# EAGLE design ServoToolv04 (EAGLE 8.3.0)
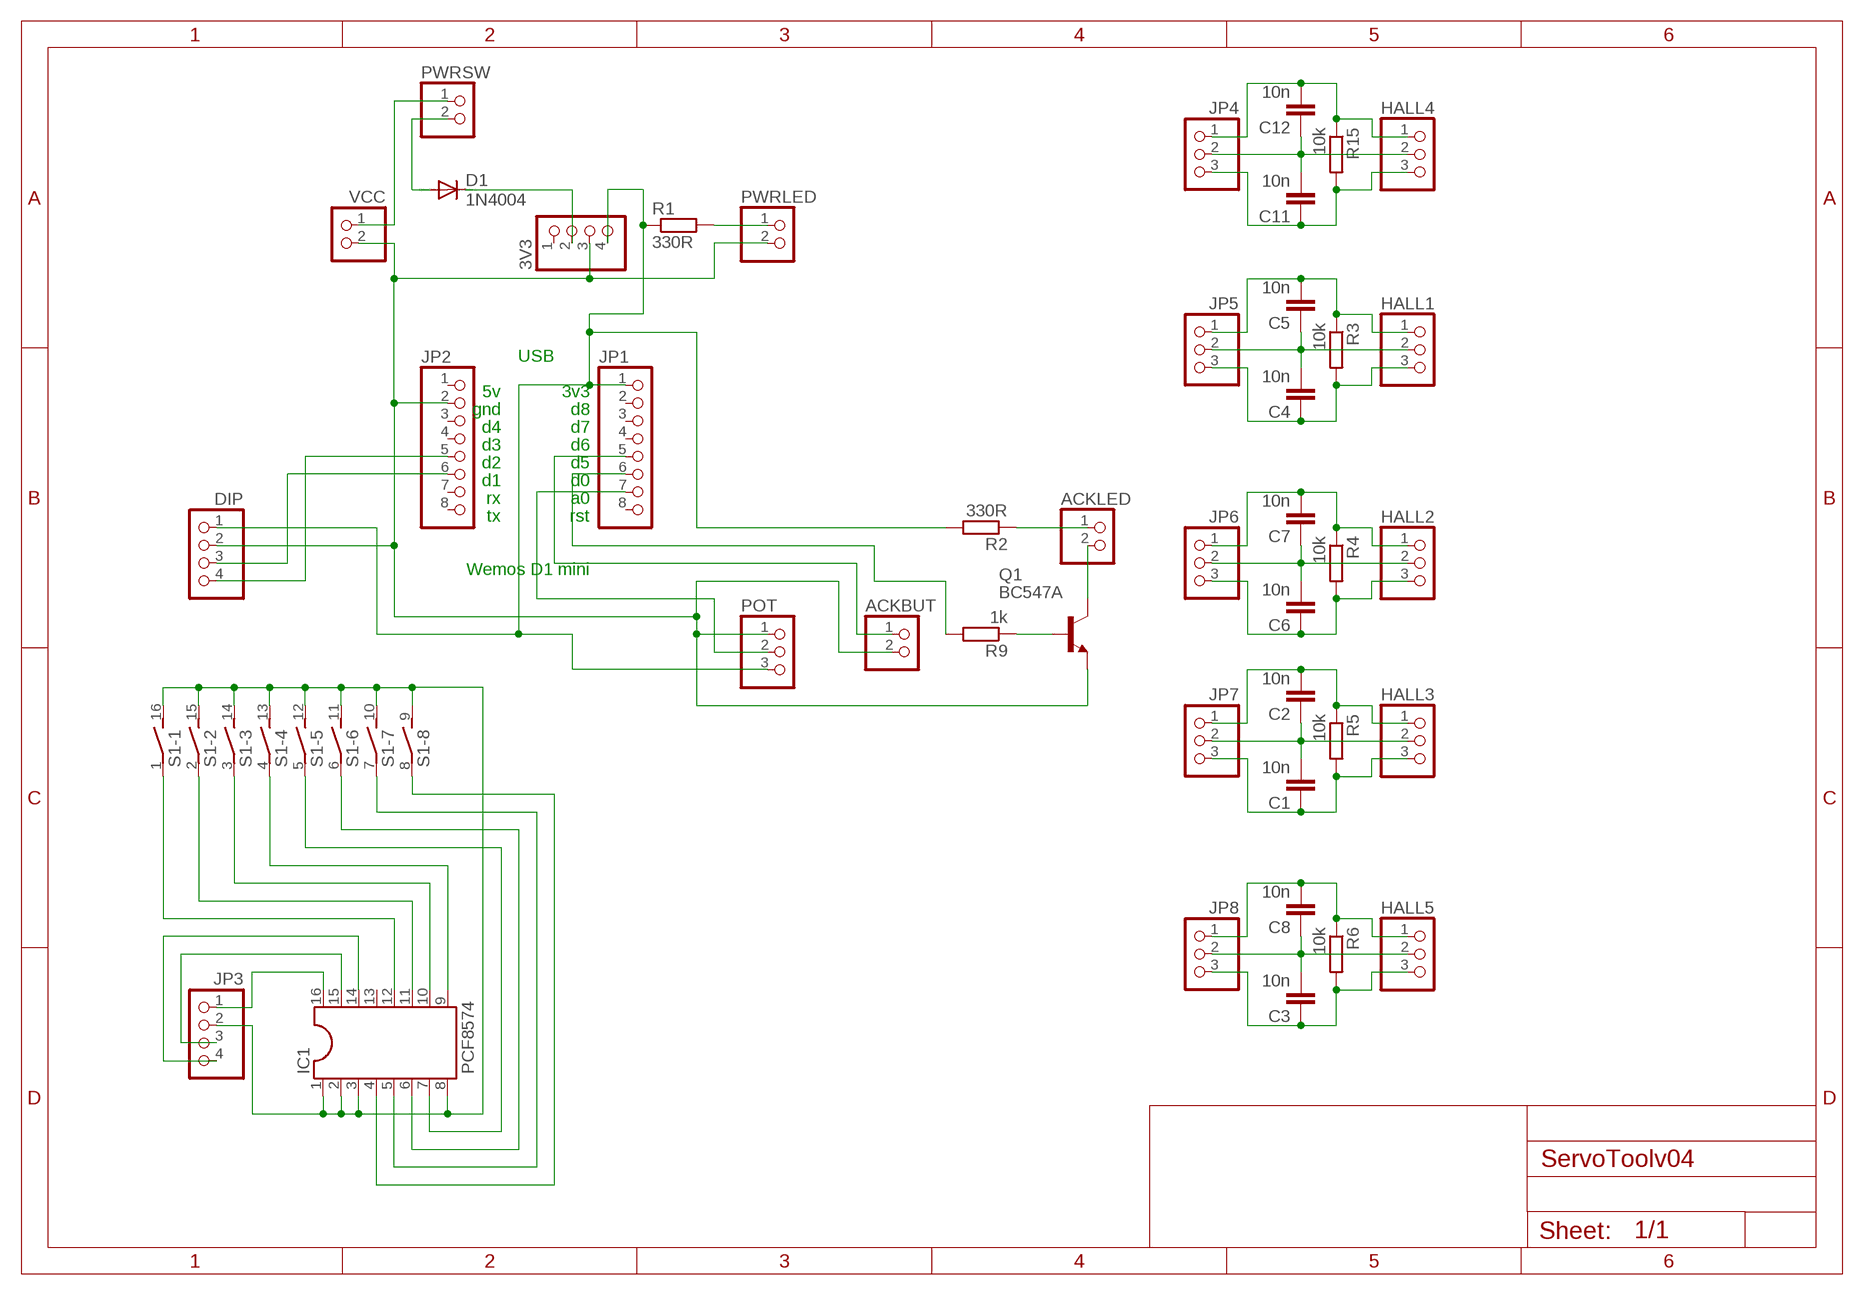
[diagram p0: schematic, sheet 1]

## Parts
3V3  PINHD-1X4  [1X04]
ACKBUT  PINHD-1X2/90  [1X02/90]
ACKLED  PINHD-1X2/90  [1X02/90]
C1  10n  C-EU050-024X044  [C050-024X044]
C2  10n  C-EU050-024X044  [C050-024X044]
C3  10n  C-EU050-024X044  [C050-024X044]
C4  10n  C-EU050-024X044  [C050-024X044]
C5  10n  C-EU050-024X044  [C050-024X044]
C6  10n  C-EU050-024X044  [C050-024X044]
C7  10n  C-EU050-024X044  [C050-024X044]
C8  10n  C-EU050-024X044  [C050-024X044]
C11  10n  C-EU050-024X044  [C050-024X044]
C12  10n  C-EU050-024X044  [C050-024X044]
D1  1N4004  [DO41-10]
DIP  PINHD-1X4/90  [1X04/90]
HALL1  PINHD-1X3  [1X03]
HALL2  PINHD-1X3  [1X03]
HALL3  PINHD-1X3  [1X03]
HALL4  PINHD-1X3  [1X03]
HALL5  PINHD-1X3  [1X03]
IC1  PCF8574  DIL16  [DIL16]
JP1  PINHD-1X8  [1X08]
JP2  PINHD-1X8  [1X08]
JP3  PINHD-1X4/90  [1X04/90]
JP4  PINHD-1X3  [1X03]
JP5  PINHD-1X3  [1X03]
JP6  PINHD-1X3  [1X03]
JP7  PINHD-1X3  [1X03]
JP8  PINHD-1X3  [1X03]
POT  PINHD-1X3/90  [1X03/90]
PWRLED  PINHD-1X2/90  [1X02/90]
PWRSW  PINHD-1X2/90  [1X02/90]
Q1  BC547A  [TO92]
R1  330R  R-EU_0207/10  [0207/10]
R2  330R  R-EU_0207/10  [0207/10]
R3  10k  R-EU_0309/10  [0309/10]
R4  10k  R-EU_0309/10  [0309/10]
R5  10k  R-EU_0309/10  [0309/10]
R6  10k  R-EU_0309/10  [0309/10]
R9  1k  R-EU_0207/10  [0207/10]
R15  10k  R-EU_0309/10  [0309/10]
S1  DIP08S  [DIP08S]
VCC  PINHD-1X2/90  [1X02/90]

## Nets
N$1 [3.3V]: 3V3.4 DIP.1 JP1.1 POT.3 R1.1 R2.2
N$2: DIP.3 JP2.6
N$3: DIP.4 JP2.5
N$4 [5V]: 3V3.2 D1.C
N$5 [5V]: PWRSW.1 VCC.1
N$6: PWRLED.1 R1.2
N$7: Q1.2(B) R9.1
N$8: ACKLED.1 R2.1
N$9: ACKLED.2 Q1.3(C)
N$10: IC1.12 S1.1
N$11: IC1.11 S1.2
N$12: IC1.10 S1.3
N$13: IC1.16 JP3.1
N$14: ACKBUT.1 JP1.5
N$15: JP1.7 POT.2
N$16: C5.2 HALL1.1 JP5.1 R3.1
N$17: JP1.6 R9.2
N$18 [5V]: D1.A PWRSW.2
N$19 [Gnd]: 3V3.3 ACKBUT.2 DIP.2 JP2.2 POT.1 PWRLED.2 Q1.1(E) VCC.2
N$20: C4.2 C5.1 HALL1.2 JP5.2
N$21 [Gnd]: IC1.1 IC1.2 IC1.3 IC1.8 JP3.2 S1.9 S1.10 S1.11 S1.12 S1.13 S1.14 S1.15 S1.16
N$22: IC1.15 JP3.3
N$23: IC1.14 JP3.4
N$24: IC1.9 S1.4
N$25: IC1.7 S1.5
N$26: IC1.6 S1.6
N$27: C4.1 HALL1.3 JP5.3 R3.2
N$28: C6.2 C7.1 HALL2.2 JP6.2
N$29: IC1.5 S1.7
N$30: C7.2 HALL2.1 JP6.1 R4.1
N$31: C6.1 HALL2.3 JP6.3 R4.2
N$32: C1.2 C2.1 HALL3.2 JP7.2
N$33: C2.2 HALL3.1 JP7.1 R5.1
N$34: C1.1 HALL3.3 JP7.3 R5.2
N$35: IC1.4 S1.8
N$36: C3.2 C8.1 HALL5.2 JP8.2
N$37: C8.2 HALL5.1 JP8.1 R6.1
N$38: C3.1 HALL5.3 JP8.3 R6.2
N$55: C11.2 C12.1 HALL4.2 JP4.2
N$56: C11.1 HALL4.3 JP4.3 R15.2
N$57: C12.2 HALL4.1 JP4.1 R15.1
Unconnected: 3V3.1 IC1.13 JP1.2 JP1.3 JP1.4 JP1.8 JP2.1 JP2.3 JP2.4 JP2.7 JP2.8

## Notes on the sheet
- USB
- 5v | 3v3
- gnd | d8
- d4 | d7
- d3 | d6
- d2 | d5
- d1 | d0
- rx | a0
- tx | rst
- Wemos D1 mini

## Library data of the parts
3V3 DIP JP3 = pinhead:PINHD-1X4: PIN HEADER
ACKBUT ACKLED PWRLED PWRSW VCC = pinhead:PINHD-1X2: PIN HEADER
C1-C8 C11 C12 = resistor:C-EU: CAPACITOR, European symbol
D1 = diode:1N4004: DIODE general purpose rectifier, 1 A
HALL1-HALL5 JP4-JP8 POT = pinhead:PINHD-1X3: PIN HEADER
IC1 = ic-package:DIL16: Dual In Line / Socket
JP1 JP2 = pinhead:PINHD-1X8: PIN HEADER
Q1 = transistor-npn:BC547*: NPN Transistor
R1-R6 R9 R15 = resistor:R-EU_: RESISTOR, European symbol
S1 = switch-dil:DIP08S: DIL/CODE SWITCH; OC_FARNELL: unknown; OC_NEWARK: unknown

## Net classes
0 default: width 0.508 mm, clearance 0.254 mm
1 5V: width 0.508 mm, clearance 0.254 mm
2 Gnd: width 0.508 mm, clearance 0.254 mm
4 3.3V: width 0.508 mm, clearance 0.254 mm

## Board
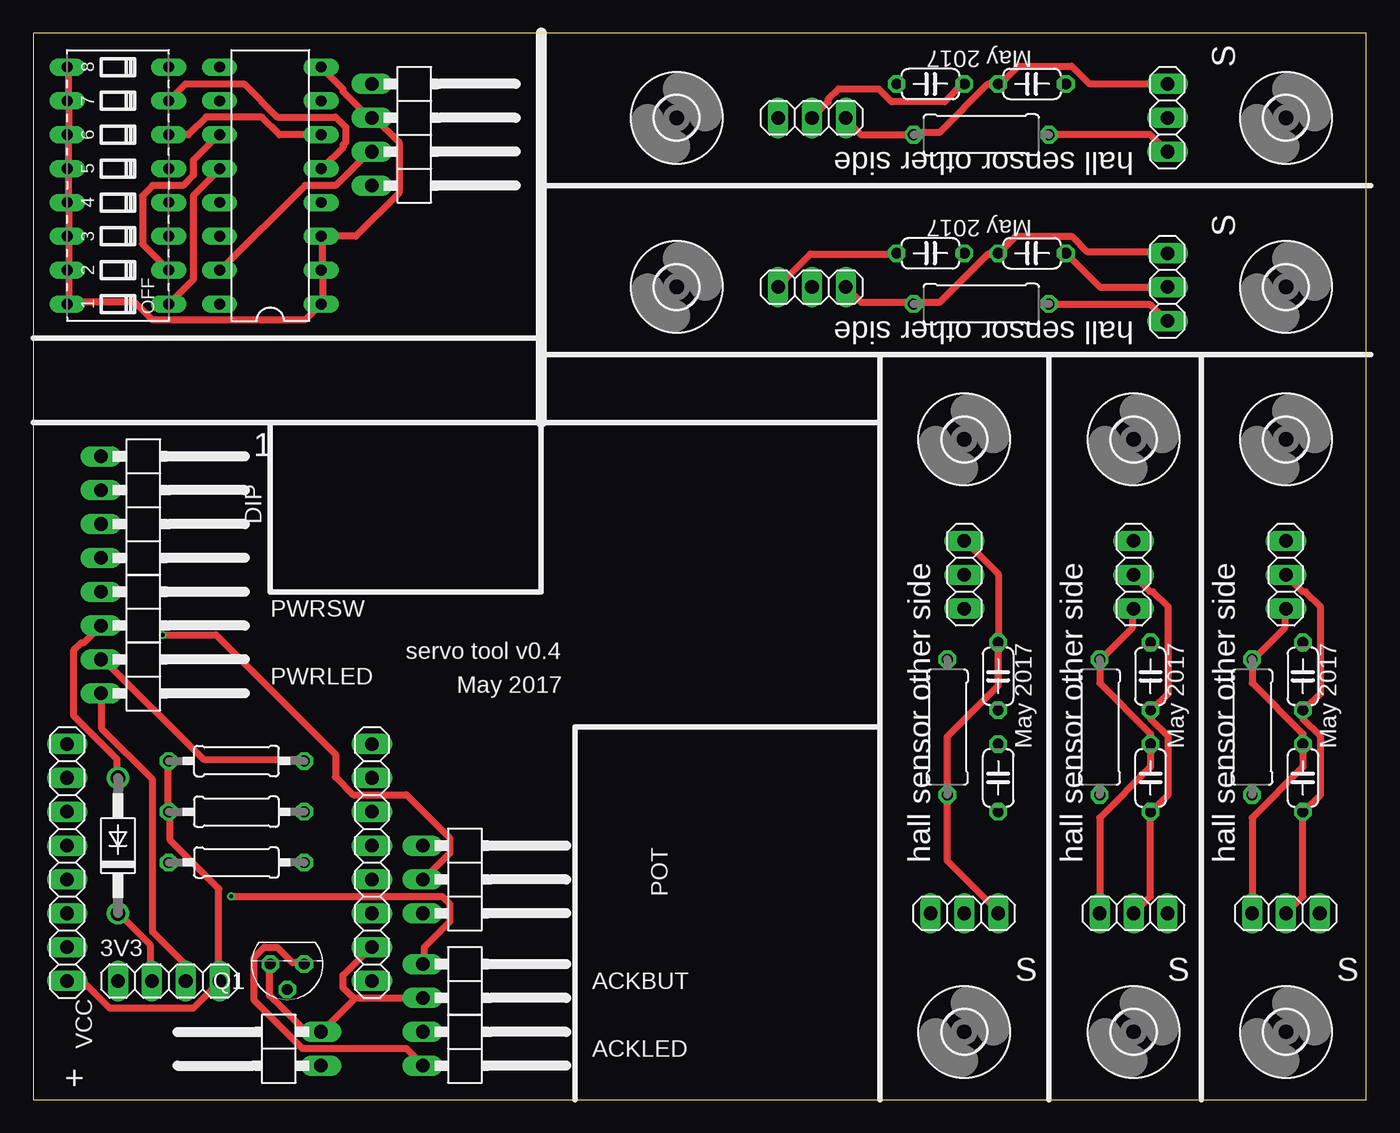
[diagram p1: board, top side]
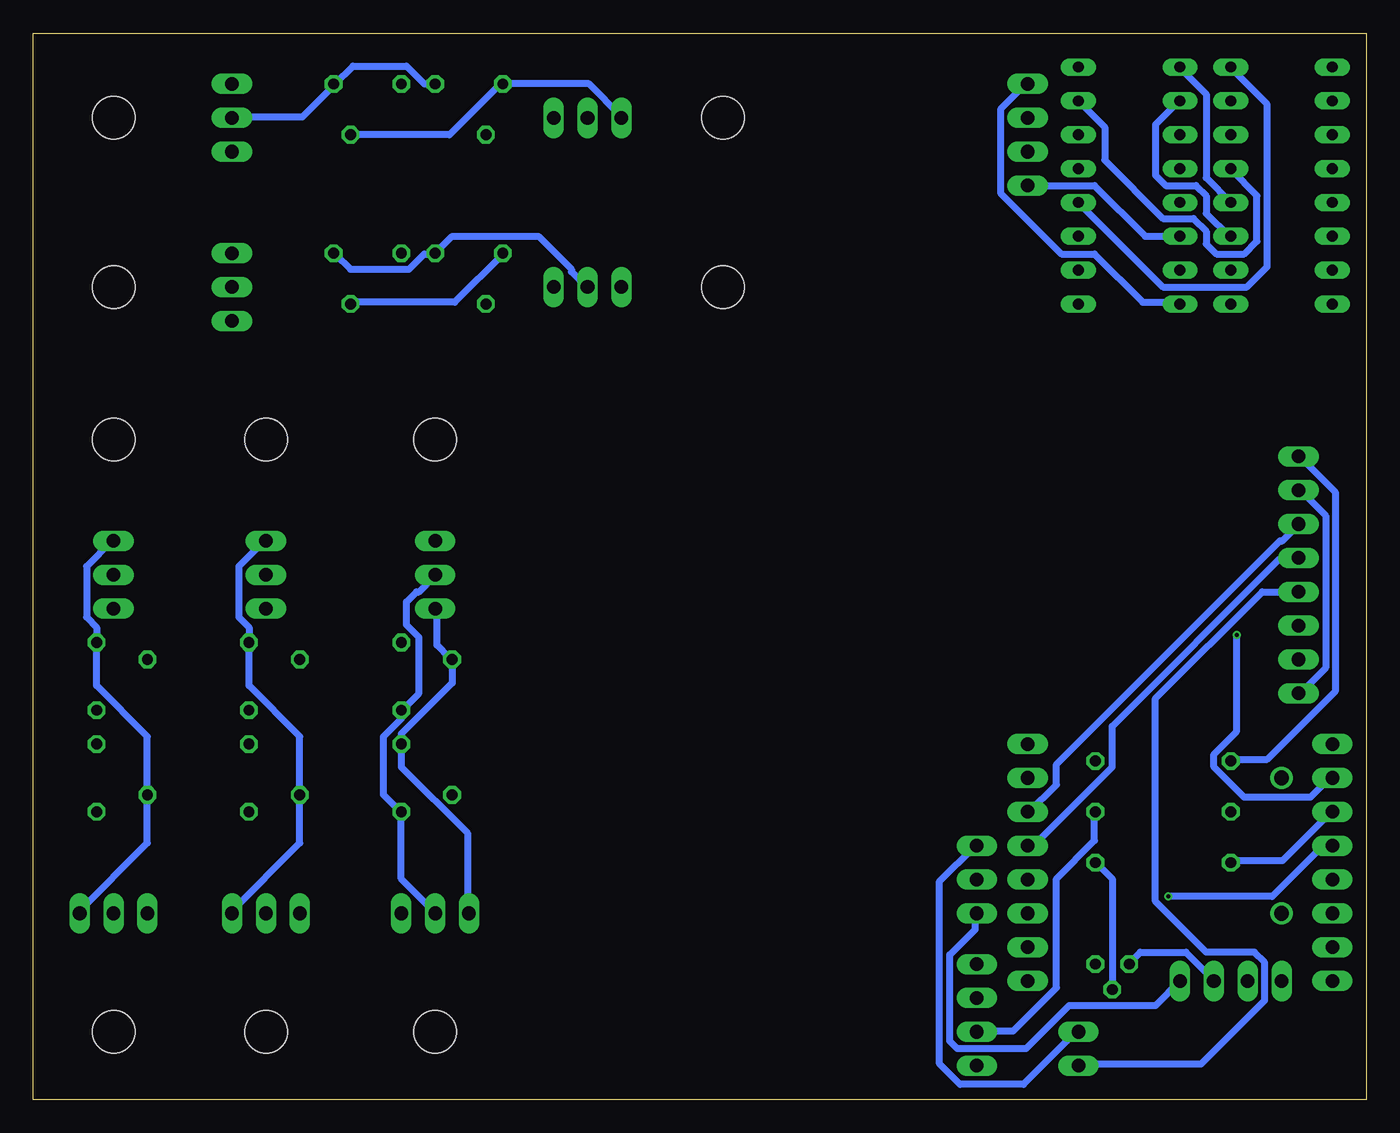
[diagram p2: board, bottom side, seen from below]

Size 100 x 80 mm. Coordinates in mm from the lower left corner, seen from the top.
Outline: 0,0 100,0 100,80 0,80 0,0
Copper layers (1*16): Top 0.035mm / dielectric 1.5mm / Bottom 0.035mm
Design rules "NOA Eagle Rule 2016-06-12": minimum track width 6mil, minimum drill 0.3mm, track to track 6mil, track to pad 6mil, pad to pad 6mil, via to via 6mil, smd to smd 0mil, copper to edge 0.4mm, drill to drill 10mil, minimum pad ring 10mil, minimum via ring 6mil, stop-mask expansion 2mil, vias tented up to drill 25mil, thermal gap 10mil
tRestrict: 8 lines
bRestrict: 8 lines

### Footprints (pad centres in the part's own frame; a part is rotated, then mirrored left to right if it is on the bottom)
1X04 = drill 1.016 long: 1 -3.81,0; 2 -1.27,0; 3 1.27,0; 4 3.81,0
1X02/90 = drill 1.016 long: 1 -1.27,-3.81; 2 1.27,-3.81
C050-024X044 = drill 0.813 octagon: 1 -2.54,0; 2 2.54,0
DO41-10 = drill 1.118: A 5.08,0; C -5.08,0
1X04/90 = drill 1.016 long: 1 -3.81,-3.81; 2 -1.27,-3.81; 3 1.27,-3.81; 4 3.81,-3.81
1X03 = drill 1.016 long: 1 -2.54,0; 2 0,0; 3 2.54,0
DIL16 = drill 0.813 long: 1 -8.89,-3.81; 2 -6.35,-3.81; 3 -3.81,-3.81; 4 -1.27,-3.81; 5 1.27,-3.81; 6 3.81,-3.81; 7 6.35,-3.81; 8 8.89,-3.81; 9 8.89,3.81; 10 6.35,3.81; 11 3.81,3.81; 12 1.27,3.81; 13 -1.27,3.81; 14 -3.81,3.81; 15 -6.35,3.81; 16 -8.89,3.81
1X08 = drill 1.016 long: 1 -8.89,0; 2 -6.35,0; 3 -3.81,0; 4 -1.27,0; 5 1.27,0; 6 3.81,0; 7 6.35,0; 8 8.89,0
1X03/90 = drill 1.016 long: 1 -2.54,-3.81; 2 0,-3.81; 3 2.54,-3.81
TO92 = drill 0.813 octagon: 1 1.27,0; 2 0,1.905; 3 -1.27,0
0207/10 = drill 0.813 octagon: 1 -5.08,0; 2 5.08,0
0309/10 = drill 0.813 octagon: 1 -5.08,0; 2 5.08,0
DIP08S = drill 0.813 long: 1 -8.89,-3.81; 2 -6.35,-3.81; 3 -3.81,-3.81; 4 -1.27,-3.81; 5 1.27,-3.81; 6 3.81,-3.81; 7 6.35,-3.81; 8 8.89,-3.81; 9 8.89,3.81; 10 6.35,3.81; 11 3.81,3.81; 12 1.27,3.81; 13 -1.27,3.81; 14 -3.81,3.81; 15 -6.35,3.81; 16 -8.89,3.81
3,2 = hole 3.2: 0,0

### Placement (x,y rotation side)
3V3  10.16,8.89 0 top
ACKBUT  33.02,8.89 270 top
ACKLED  33.02,3.81 270 top
C1  83.82,24.13 270 top
C2  83.82,31.75 90 top
C3  95.25,24.13 270 top
C4  67.31,76.2 0 top
C5  74.93,76.2 180 top
C6  67.31,63.5 0 top
C7  74.93,63.5 180 top
C8  95.25,31.75 90 top
C11  72.39,24.13 270 top
C12  72.39,31.75 90 top
D1  6.35,19.05 90 top
DIP  8.89,44.45 270 top
HALL1  58.42,73.66 180 top
HALL2  58.42,60.96 180 top
HALL3  82.55,39.37 270 top
HALL4  69.85,39.37 270 top
HALL5  93.98,39.37 270 top
IC1  17.78,68.58 90 top
JP1  2.54,17.78 90 top
JP2  25.4,17.78 90 top
JP3  29.21,72.39 270 top
JP4  69.85,13.97 180 top
JP5  85.09,73.66 270 top
JP6  85.09,60.96 270 top
JP7  82.55,13.97 180 top
JP8  93.98,13.97 180 top
POT  33.02,16.51 270 top
PWRLED  8.89,31.75 270 top
PWRSW  8.89,36.83 270 top
Q1  19.05,10.16 180 top
R1  15.24,25.4 0 top
R2  15.24,21.59 180 top
R3  71.12,72.39 0 top
R4  71.12,59.69 0 top
R5  80.01,27.94 90 top
R6  91.44,27.94 90 top
R9  15.24,17.78 180 top
R15  68.58,27.94 90 top
S1  6.35,68.58 90 top
U$1  [3,2]  48.26,73.66 0 top
U$2  [3,2]  93.98,73.66 0 top
U$3  [3,2]  93.98,60.96 0 top
U$4  [3,2]  48.26,60.96 0 top
U$5  [3,2]  69.85,49.53 0 top
U$6  [3,2]  82.55,49.53 0 top
U$7  [3,2]  93.98,49.53 0 top
U$8  [3,2]  69.85,5.08 0 top
U$9  [3,2]  82.55,5.08 0 top
U$10  [3,2]  93.98,5.08 0 top
VCC  17.78,3.81 90 top

### Tracks (layer width: path | path; a pad name or v marks a point on that pad's centre or on a via)
N$1
  Top 0.508: R1.1 10.1,25.34 10.1,21.72 R2.2 10.29,21.53 10.29,19.43 13.91,15.81 13.91,8.95 3V3.4 13.91,8.76 12,6.86 5.71,6.86 3.81,8.76 2.67,8.76 JP1.1
  Bottom 0.508: DIP.1 4.95,48.2 2.29,45.53 2.29,30.67 7.43,25.53 10.1,25.53 R1.1 | 3V3.4 15.81,7.05 22.29,7.05 25.53,3.81 30.67,3.81 31.24,4.38 31.24,10.86 29.34,12.76 29.34,13.91 POT.3
N$2
  Bottom 0.508: DIP.3 5.14,43.05 6.29,41.91 6.48,41.91 23.24,25.15 23.24,23.62 25.34,21.53 JP2.6
N$3
  Bottom 0.508: JP2.5 24.96,19.05 19.05,24.96 19.05,28 6.48,40.58 5.14,40.58 DIP.4
N$4
  Top 0.508: 3V3.2 8.76,8.95 8.76,11.62 6.48,13.91 D1.C
N$5
  Bottom 0.508: PWRSW.1 7.81,38.1 15.81,30.1 15.81,14.86 12,11.05 8.38,11.05 7.62,10.29 7.62,7.43 12.38,2.67 21.53,2.67 VCC.1
N$6
  Top 0.508: R1.2 20.19,25.53 12.76,25.53 5.14,33.15 PWRLED.1
N$7
  Bottom 0.508: Q1.2 19.05,16.57 20.19,17.72 R9.1
N$8
  Bottom 0.508: R2.1 20.38,21.53 20.38,19.43 23.24,16.57 23.24,8.38 26.48,5.14 29.15,5.14 ACKLED.1
N$9
  Top 0.508: Q1.3 20.19,10.29 19.43,10.29 18.29,11.43 17.34,11.43 16.57,10.67 16.57,7.43 20.19,3.81 28,3.81 29.15,2.67 ACKLED.2
N$10
  Top 0.508: S1.1 12,61.53 12,67.82 13.91,69.72 IC1.12
N$11
  Top 0.508: S1.2 8.19,64.2 8.19,67.82 8.95,68.58 11.24,68.58 12,69.34 12,70.48 13.91,72.39 IC1.11
N$12
  Bottom 0.508: S1.3 10.29,64.77 12,66.48 12,67.82 12.76,68.58 15.05,68.58 15.81,69.34 15.81,73.15 14.1,74.87 IC1.10
N$13
  Bottom 0.508: IC1.16 14.1,59.82 16.76,59.82 20.38,63.44 22.86,63.44 27.43,68.01 27.43,74.3 25.53,76.2 JP3.1
N$14  (via drill 0.3)
  Top 0.508: v14.86,15.24 30.67,15.24 31.24,14.67 31.24,13.34 29.34,11.43 29.34,10.29 ACKBUT.1
  Bottom 0.508: v14.86,15.24 7.05,15.24 3.24,19.05 JP1.5
N$15  (via drill 0.3)
  Top 0.508: v9.72,34.86 13.72,34.86 22.67,25.91 22.67,24.19 24,22.86 28,22.86 31.24,19.62 31.24,18.48 29.34,16.57 POT.2
  Bottom 0.508: v9.72,34.86 9.72,27.62 11.43,25.91 11.43,24.96 9.14,22.67 4.19,22.67 2.67,24.19 JP1.7
N$16
  Top 0.508: HALL1.1 60.96,73.53 62.1,72.39 R3.1 66.1,72.58 68.01,72.58 71.63,76.2 C5.2 72.58,76.2 73.91,77.53 77.92,77.53 79.25,76.2 JP5.1
N$17
  Bottom 0.508: R9.2 10.1,17.91 6.29,17.91 2.67,21.53 JP1.6
N$18
  Top 0.508: PWRSW.2 3.81,34.29 3.62,34.29 3.05,33.72 3.05,28.77 6.29,25.53 6.29,24.19 D1.A
N$19
  Top 0.508: Q1.1 17.72,10.1 17.72,7.81 20.38,5.14 21.53,5.14 VCC.2 21.72,5.14 24.19,7.62 | 24.19,7.62 ACKBUT.2 | JP2.2 25.34,11.43 23.24,9.34 23.24,8.38 24,7.62 24.19,7.62 | 3V3.3 11.43,10.1 8.95,12.57 8.95,24 5.14,27.81 5.14,30.48 PWRLED.2
  Bottom 0.508: PWRLED.2 4.95,30.48 3.05,32.38 3.05,43.81 4.95,45.72 DIP.2 | 3V3.3 11.43,8.95 13.53,11.05 16.95,11.05 17.72,10.29 Q1.1 | POT.1 29.34,19.05 32,16.38 32,2.67 30.48,1.14 25.72,1.14 21.72,5.14 VCC.2
N$20
  Top 0.508: HALL1.2 59.63,74.87 59.63,75.06 60.39,75.82 63.44,75.82 64.39,74.87 68.39,74.87 69.72,76.2 C4.2
  Bottom 0.508: C4.2 70.67,76.2 72.01,77.53 76.01,77.53 77.34,76.2 C5.1 77.53,76.01 79.82,73.72 84.96,73.72 JP5.2
N$21
  Top 0.508: S1.9 2.67,77.34 2.67,75.06 S1.10 2.67,74.87 2.67,72.39 S1.11 2.67,72.2 2.67,69.91 S1.12 2.67,69.72 2.67,67.44 S1.13 2.67,67.25 2.67,64.77 S1.14 2.67,64.58 2.67,62.29 S1.15 2.67,62.1 2.67,59.82 S1.16 2.86,59.82 7.62,59.82 8.95,58.48 20.38,58.48 IC1.1 21.72,59.82 21.72,62.1 IC1.2 21.72,62.29 21.72,64.77 IC1.3 24.19,64.77 27.43,68.01 27.43,71.82 25.53,73.72 JP3.2 25.34,73.53 23.24,75.63 23.24,75.82 IC1.8
N$22
  Top 0.508: IC1.15 14.1,62.29 20.38,68.58 22.67,68.58 25.34,71.25 JP3.3
N$23
  Bottom 0.508: IC1.14 16.57,64.77 20.38,68.58 JP3.4
N$24
  Bottom 0.508: S1.4 12,69.15 12,75.44 13.91,77.34 IC1.9
N$25
  Bottom 0.508: IC1.7 19.62,72.96 19.62,70.48 15.24,66.1 12.95,66.1 12,65.15 12,64.2 11.24,63.44 9.14,63.44 8.19,64.39 8.19,67.82 10.1,69.72 S1.5
N$26
  Top 0.508: S1.6 11.62,72.39 12.95,73.72 17.14,73.72 18.48,72.39 IC1.6
N$27
  Top 0.508: R3.2 83.82,72.39 JP5.3
  Bottom 0.508: HALL1.3 55.82,73.72 58.29,76.2 C4.1 64.96,76.2 68.77,72.39 R3.2
N$28
  Top 0.508: JP6.2 80.01,60.96 C7.1
  Bottom 0.508: C7.1 77.34,63.44 76.2,62.29 71.82,62.29 70.67,63.44 69.91,63.44 C6.2 68.58,64.77 62.1,64.77 59.63,62.29 59.63,62.1 58.48,60.96 HALL2.2
N$29
  Top 0.508: S1.7 11.43,76.2 15.81,76.2 18.29,73.72 22.67,73.72 23.43,72.96 23.43,71.82 23.24,71.63 23.24,71.44 21.72,69.91 IC1.5
N$30
  Top 0.508: HALL2.1 62.1,59.82 65.91,59.82 R4.1 66.1,59.82 68.01,59.82 71.63,63.44 72.39,63.44 C7.2 72.58,63.63 73.72,64.77 77.92,64.77 79.06,63.63 84.96,63.63 JP6.1
N$31
  Top 0.508: R4.2 76.2,59.63 83.82,59.63 84.96,58.48 JP6.3 | C6.1 64.77,63.44 58.29,63.44 55.82,60.96 HALL2.3
  Bottom 0.508: R4.2 76.2,59.82 68.39,59.82 64.77,63.44 C6.1
N$32
  Top 0.508: JP7.2 83.82,15.24 C1.2 84.01,21.72 85.15,22.86 85.15,27.24 83.82,28.57 C2.1 84.01,29.34 85.15,30.48 85.15,36.96 84.01,38.1 83.82,38.1 HALL3.2
N$33
  Bottom 0.508: HALL3.1 82.68,41.91 84.58,40.01 84.58,36.2 83.82,35.43 C2.2 83.82,31.05 80.01,27.24 R5.1 80.01,19.24 85.15,14.1 JP7.1
N$34
  Top 0.508: JP7.3 80.01,21.14 83.82,24.96 C1.1 83.82,27.43 80.01,31.24 R5.2 80.2,33.15 82.49,35.43 82.49,36.77 HALL3.3
N$35
  Bottom 0.508: IC1.4 15.24,60.96 8.95,60.96 7.43,62.48 7.43,74.68 10.1,77.34 S1.8
N$36
  Top 0.508: JP8.2 95.25,15.24 C3.2 95.44,21.72 96.58,22.86 96.58,27.24 95.25,28.57 C8.1 95.44,29.34 96.58,30.48 96.58,36.96 95.44,38.1 95.25,38.1 HALL5.2
N$37
  Bottom 0.508: HALL5.1 94.11,41.91 96.01,40.01 96.01,36.2 95.25,35.43 C8.2 95.25,31.05 91.44,27.24 R6.1 91.44,19.24 96.58,14.1 JP8.1
N$38
  Top 0.508: JP8.3 91.44,21.14 95.25,24.96 C3.1 95.25,27.43 91.44,31.24 R6.2 91.63,33.15 93.92,35.43 93.92,36.77 HALL5.3
N$55
  Bottom 0.508: JP4.2 69.91,14.1 72.39,16.57 C11.2 72.58,21.72 73.72,22.86 73.72,27.24 72.39,28.57 C12.1 72.2,29.34 71.06,30.48 71.06,34.67 72.01,35.62 72.01,37.34 71.25,38.1 71.06,38.1 69.91,39.24 HALL4.2
N$56
  Bottom 0.508: JP4.3 67.44,14.1 67.44,20 72.39,24.96 C11.1 72.39,27.43 68.58,31.24 R15.2 68.77,33.15 69.72,34.1 69.72,36.77 HALL4.3
N$57
  Top 0.508: HALL4.1 69.91,41.91 72.39,39.43 C12.2 72.39,31.05 68.58,27.24 R15.1 68.58,17.91 72.39,14.1 JP4.1

### Text on the board
tNames: May 2017 | S | hall sensor other side | May 2017 | S | hall sensor other side | 1 | May 2017 | May 2017 | May 2017 | servo tool v0.4 | May 2017 | hall sensor other side | hall sensor other side | hall sensor other side | S | S | S | +